# Altium project Resolver_digital.PrjPcb
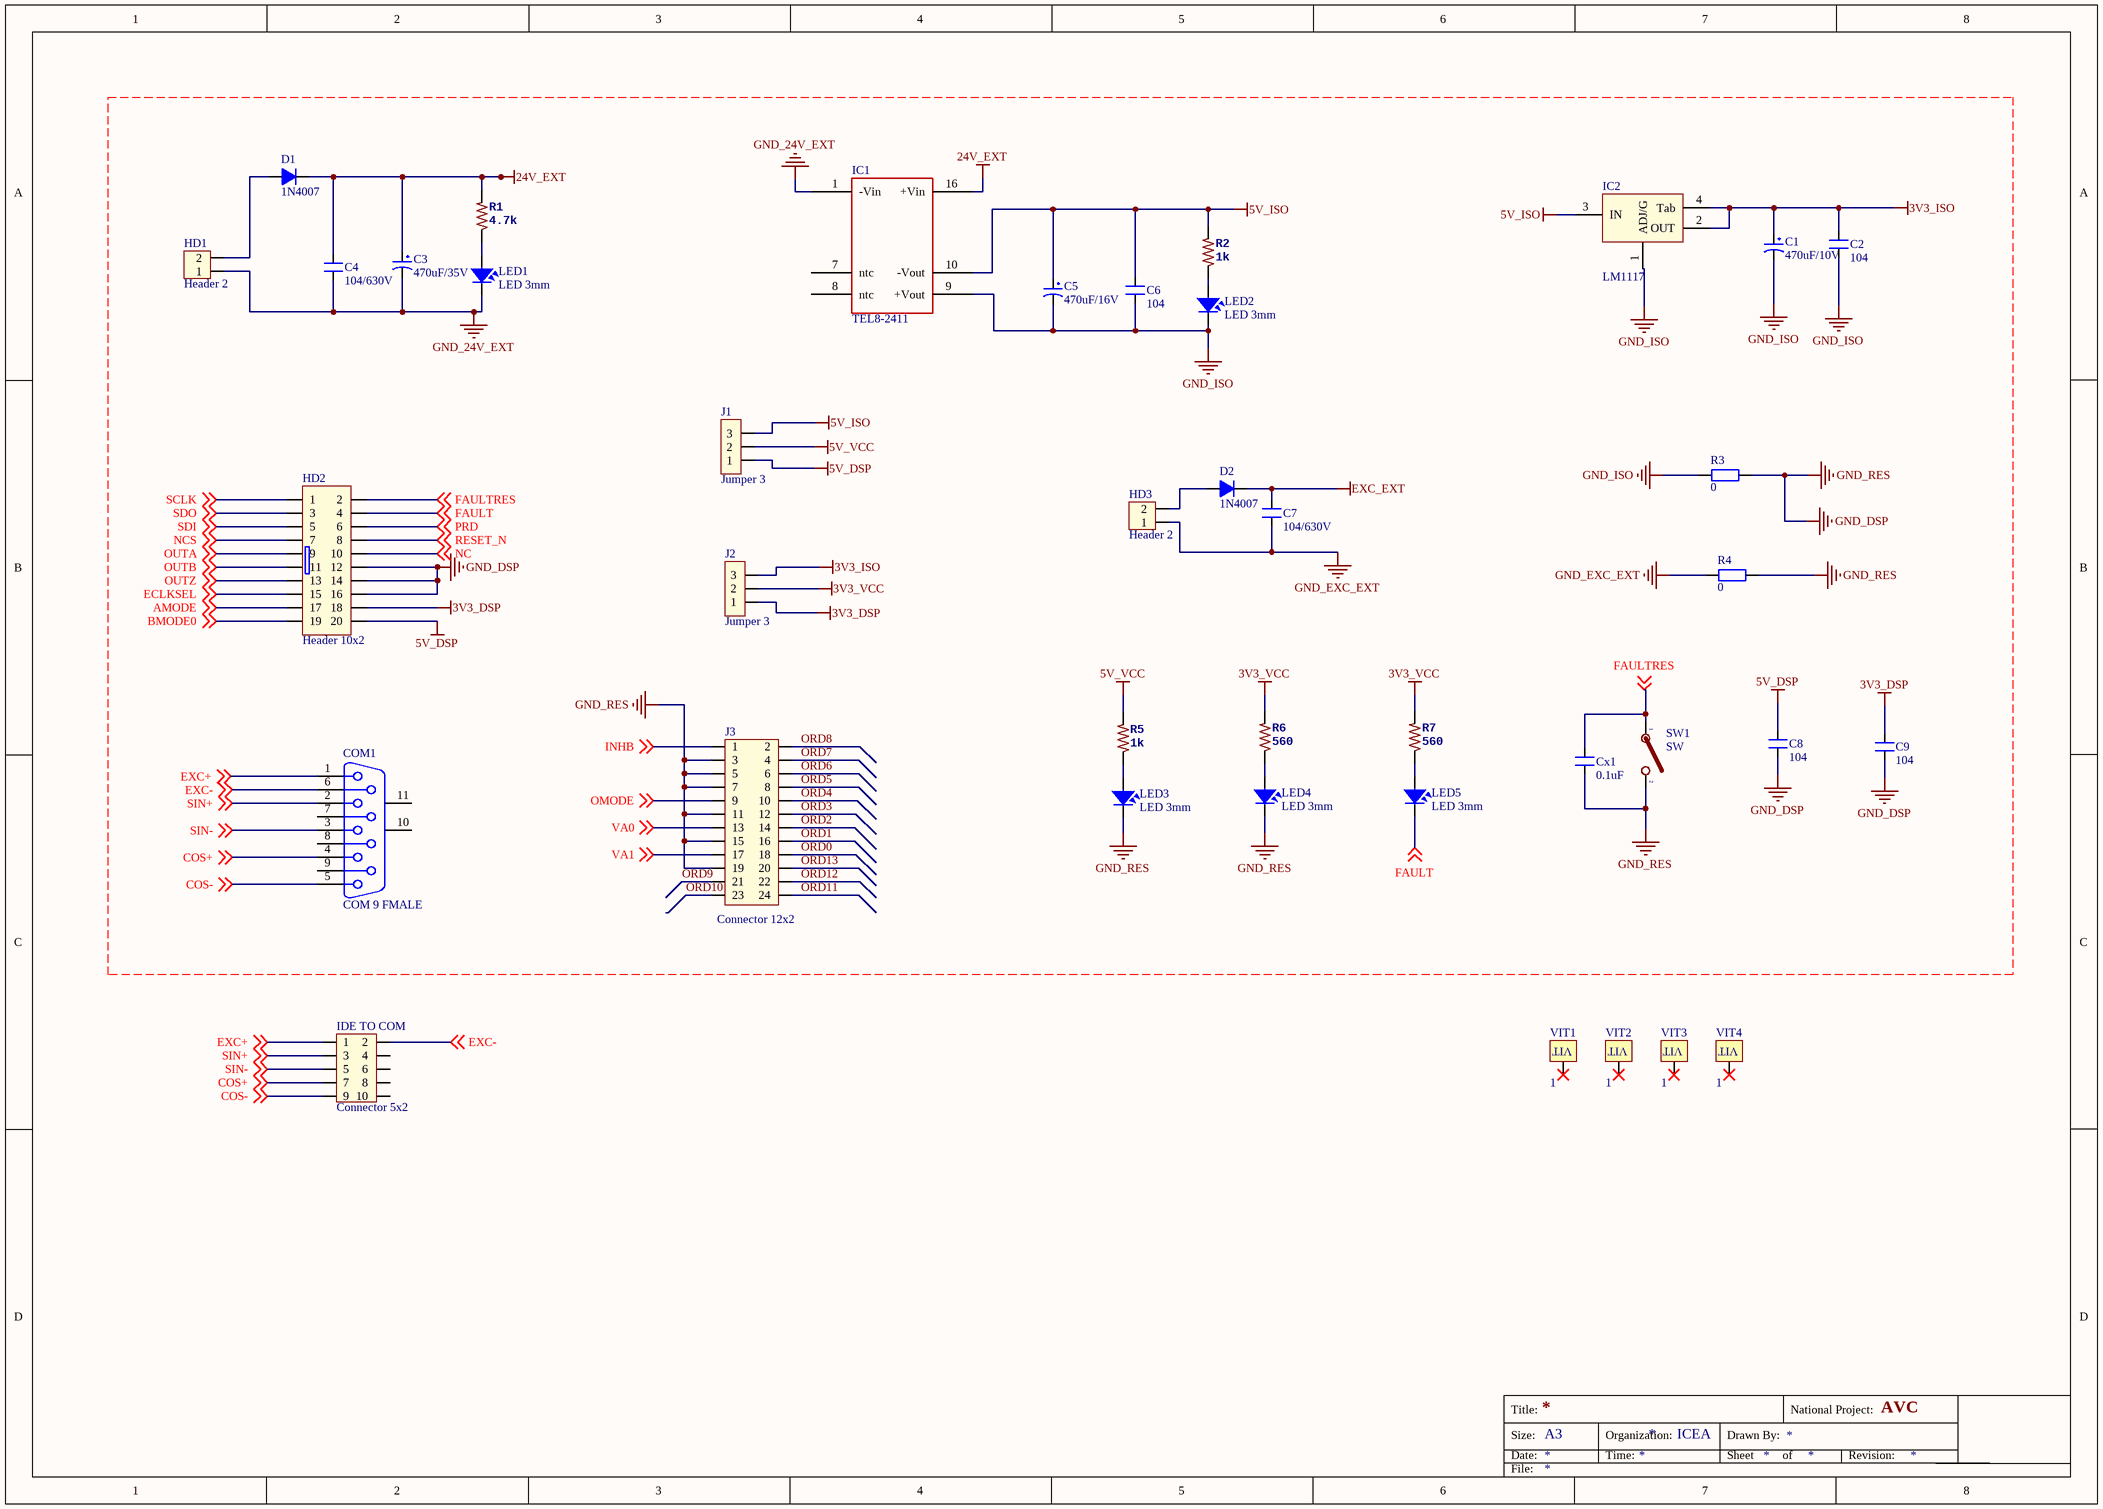
[diagram p0: QEP.SchDoc]
2 sheets, 127 parts. Net scope: global (net labels, ports and power ports of the same name join across sheets).
Board file: Resolver_PCB.PcbDoc
Sheets:
  QEP.SchDoc
  Resolver.SchDoc

## Sheet QEP.SchDoc
size A3

### Parts
C1  470uF/10V  [CP 470uF/35V SMD 10x10mm]
C2  104  [CN1.5]
C3  470uF/35V  [CP 470uF/35V SMD 10x10mm]
C4  104/630V  [CN3]
C5  470uF/16V  [CP 470uF/35V SMD 10x10mm]
C6  104  [CN1.5]
C7  104/630V  [CN3]
C8  104  [CN1.5]
C9  104  [CN1.5]
COM1  COM 9 FMALE  [DSB 9-F]
Cx1  0.1uF  [CN-SMD-0805]
D1  1N4007  [DIO-SMD-106]
D2  1N4007  [DIO-SMD-106]
HD1  Header 2  [HED2T]
HD2  Header 10x2  [IDE 20]
HD3  Header 2  [HED2T]
IC1  TEL8-2411  [TEL8-2411]
IC2  LM1117  [SOT223-4N]
IDE_TO_COM  Connector 5x2  [IDE 10 duc]
J1  Jumper 3  [JP3-CLOSED]
J2  Jumper 3  [JP3-CLOSED]
J3  Connector 12x2  [JP12X2]
LED1  LED 3mm  [LED-0805-Red]
LED2  LED 3mm  [LED-0805-Red]
LED3  LED 3mm  [LED-0805-Red]
LED4  LED 3mm  [LED-0805-Red]
LED5  LED 3mm  [LED-0805-Red]
R1  4.7k  [SM-0805]
R2  1k  [RES-SMD-0805]
R3  0  [RES-SMD-0805]
R4  0  [RES-SMD-0805]
R5  1k  [RES-SMD-0805]
R6  560  [RES-SMD-0805]
R7  560  [RES-SMD-0805]
SW1  SW  [SW-SMD]
VIT1  1  [VIT]
VIT2  1  [VIT]
VIT3  1  [VIT]
VIT4  1  [VIT]

### Nets
3V3_DSP: C9.2 HD2.18 J2.1
3V3_ISO: C1.1 C2.2 IC2.2(OUT) IC2.4(Tab) J2.3
3V3_VCC: J2.2 R6.2 R7.2
5V_DSP: C8.2 HD2.20 J1.1
5V_ISO: C5.1 C6.2 IC1.10(-Vout) IC2.3(IN) J1.3 R2.2
5V_VCC: J1.2 R5.2
24V_EXT: C3.1 C4.2 D1.2(K) IC1.16(+Vin) R1.2
EXC_EXT: C7.2 D2.2(K)
GND_24V_EXT: C3.2 C4.1 HD1.1 IC1.1(-Vin) LED1.2
GND_DSP: C8.1 C9.1 Cx1.1 HD2.12 HD2.14 HD2.16 J3.3 J3.5 J3.7 J3.11 J3.15 J3.19 LED3.2 LED4.2 R3.2 R4.2 SW1.2  [also labelled GND_RES]
GND_EXC_EXT: C7.1 HD3.1 R4.1
GND_ISO: C1.2 C2.1 C5.2 C6.1 IC1.9(+Vout) IC2.1(ADJ/G) LED2.2 R3.1
AMODE: HD2.17 ; off-sheet AMODE
BMODE0: HD2.19 ; off-sheet BMODE0
COS+: COM1.4 IDE_TO_COM.7 ; off-sheet COS+
COS-: COM1.5 IDE_TO_COM.9 ; off-sheet COS-
ECLKSEL: HD2.15 ; off-sheet ECLKSEL
EXC+: COM1.1 IDE_TO_COM.1 ; off-sheet EXC+
EXC-: COM1.6 IDE_TO_COM.2 ; off-sheet EXC-
FAULT: HD2.4 LED5.2 ; off-sheet FAULT
FAULTRES: Cx1.2 HD2.2 SW1.1 ; off-sheet FAULTRES
INHB: J3.1 ; off-sheet INHB
NC: HD2.10 ; off-sheet NC
NCS: HD2.7 ; off-sheet NCS
OMODE: J3.9 ; off-sheet OMODE
ORD0: J3.18
ORD1: J3.16
ORD2: J3.14
ORD3: J3.12
ORD4: J3.10
ORD5: J3.8
ORD6: J3.6
ORD7: J3.4
ORD8: J3.2
ORD9: J3.21
ORD10: J3.23
ORD11: J3.24
ORD12: J3.22
ORD13: J3.20
OUTA: HD2.9 ; off-sheet OUTA
OUTB: HD2.11 ; off-sheet OUTB
OUTZ: HD2.13 ; off-sheet OUTZ
PRD: HD2.6 ; off-sheet PRD
RESET_N: HD2.8 ; off-sheet RESET_N
SCLK: HD2.1 ; off-sheet SCLK
SDI: HD2.5 ; off-sheet SDI
SDO: HD2.3 ; off-sheet SDO
SIN+: COM1.2 IDE_TO_COM.3 ; off-sheet SIN+
SIN-: COM1.3 IDE_TO_COM.5 ; off-sheet SIN-
VA0: J3.13 ; off-sheet VA0
VA1: J3.17 ; off-sheet VA1
NetD1_1: D1.1(A) HD1.2
NetD2_1: D2.1(A) HD3.2
NetLED1_1: LED1.1 R1.1
NetLED2_1: LED2.1 R2.1
NetLED3_1: LED3.1 R5.1
NetLED4_1: LED4.1 R6.1
NetLED5_1: LED5.1 R7.1

Not connected (* = marked no-connect by the designer): COM1 7 8 9 10(MH1) 11(MH2); IC1 7(ntc) 8(ntc); IDE_TO_COM 4 6 8 10; VIT1 1(VIT)*; VIT2 1(VIT)*; VIT3 1(VIT)*; VIT4 1(VIT)*

### Notes on the sheet
- Title:
- Size:
- Date:
- A3
- Organization:
- Time:
- ICEA
- Sheet
- Drawn By:
- of
- National Project:
- Revision:
- AVC
- File:

### Library data of the parts
C1 C3 C5 = CP3: Cap 100uF/35V - 470uF/16V; Value: 100uF/35V/50V; Description 1: 1000uF/6,3V - 470uF/16V - 330uF - 25V; Description 2: 220uF/35V - 100uF/50V - 63V - 4,7uF/200V; Description 3: 22uF => 33uF100V - 3,3uF => 4,7uF/250V; Description 4: 2,2uF =>3,3uF/350 - 2,2uF/400V - 1uF/450V
C2 C6 C8 C9 = CN1.5: Cap np 682pF => 104pF; Value: 0.01uF
C4 C7 = CN3: Cap np W0.3; Value: 0,047uF; Copyright: VanDungEvn
COM1 = DSB9F: COM 9; PackageDocument: O; Positions: 9; Gender: Receptacle; Value: COM 9; Published: 15-Jun-2001; LatestRevisionDate: 17-Jul-2002; LatestRevisionNote: Re-released for DXP Platform.; DatasheetDocument: 1-Sep-1999; PackageReference: 788750; Publisher: Altium Limited; Orientation: Right Angle
Cx1 = CN: Value: 33pF
D1 D2 = D2A: Diode 2A; Value: 1N4007
HD1 HD3 = Hed2: Header 2 (Green); Value: Header 2
HD2 = HED10X2: Value: Header 5x2
IC2 = LM1117: 3v3; Value: LM317
IDE_TO_COM = JP5x2: Value: Connector 4x2
J1 J2 = JP3: Value: J3
J3 = JP12x2: Value: Connector 4x2
LED1-LED5 = LED 3mm: LED Single colour Green and Red; Value: LED 3 ly Single Colour
R1 R2 R5-R7 = R-US_R0805: RESISTOR, American symbol
R3 R4 = R1/4W: Resistor 1/4W; Value: R1/4W - 1K
SW1 = SW: Switch button 2 pin; Value: SW chip 2 pin
VIT1-VIT4 = VIT: Oc Vit

## Sheet Resolver.SchDoc
size A3
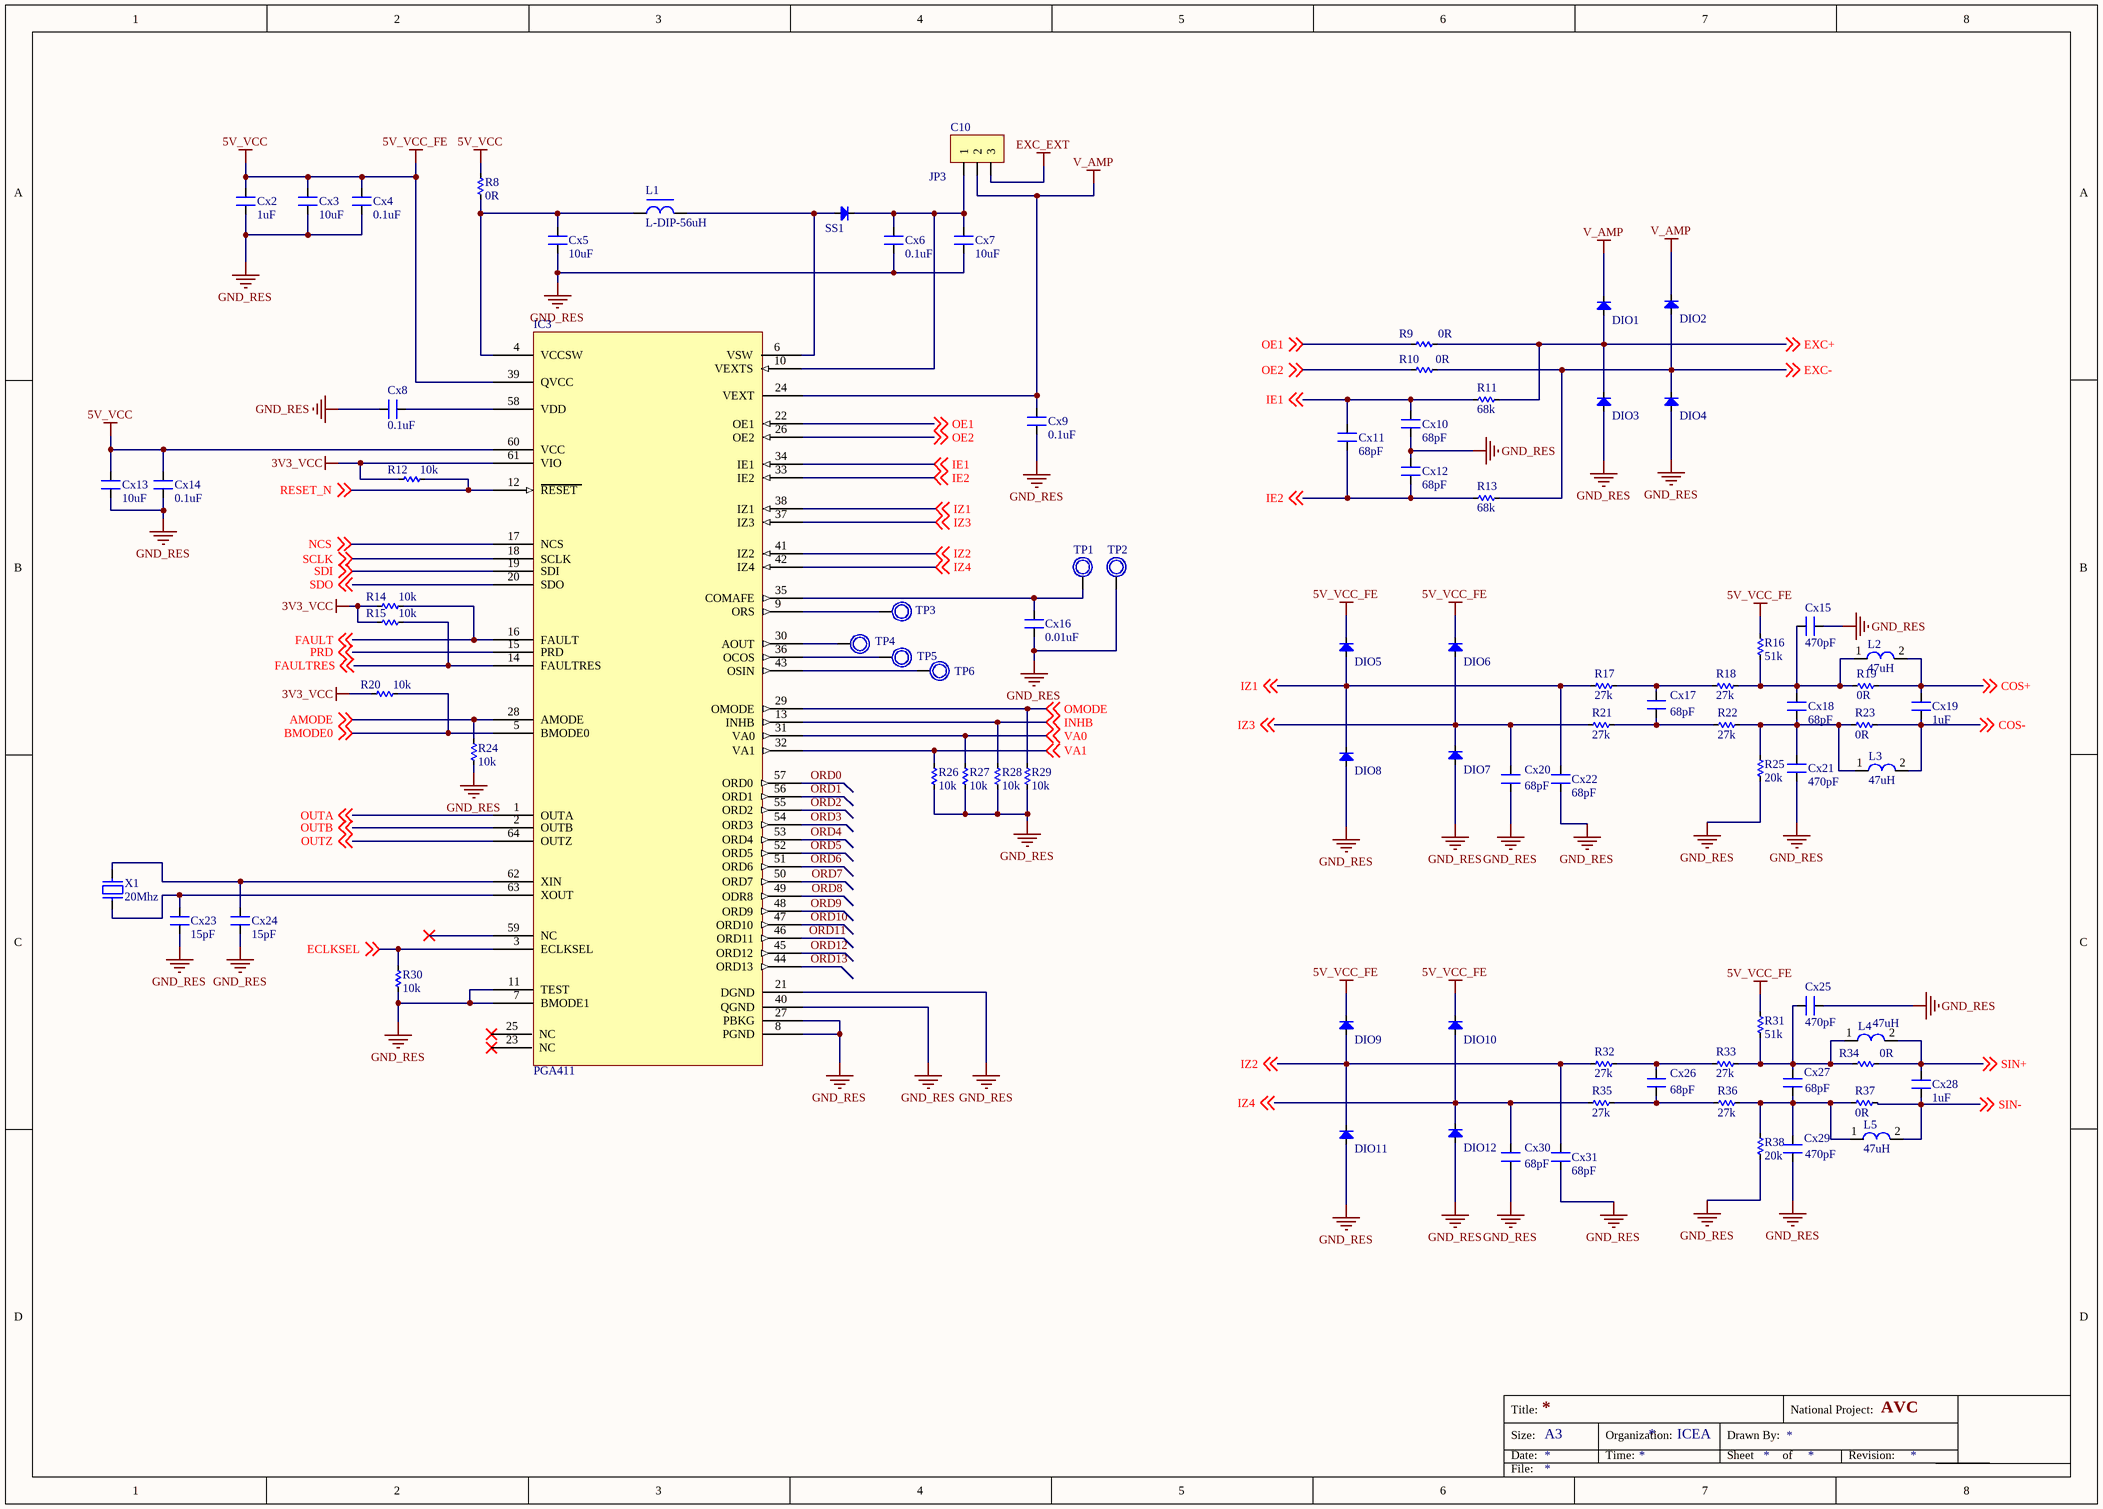
[diagram p1: Resolver.SchDoc]

### Parts
C10  JP3  [JP3-CLOSED]
Cx2  1uF  [CN-SMD-0805]
Cx3  10uF  [CN-SMD-1206]
Cx4  0.1uF  [CN-SMD-0805]
Cx5  10uF  [CN-SMD-1206]
Cx6  0.1uF  [CN-SMD-0805]
Cx7  10uF  [CN-SMD-1206]
Cx8  0.1uF  [CN-SMD-0805]
Cx9  0.1uF  [CN-SMD-0805]
Cx10  68pF  [CN-SMD-0805]
Cx11  68pF  [CN-SMD-0805]
Cx12  68pF  [CN-SMD-0805]
Cx13  10uF  [CN-SMD-1206]
Cx14  0.1uF  [CN-SMD-0805]
Cx15  470pF  [CN-SMD-0805]
Cx16  0.01uF  [CN-SMD-0805]
Cx17  68pF  [CN-SMD-0805]
Cx18  68pF  [CN-SMD-0805]
Cx19  1uF  [CN-SMD-0805]
Cx20  68pF  [CN-SMD-0805]
Cx21  470pF  [CN-SMD-0805]
Cx22  68pF  [CN-SMD-0805]
Cx23  15pF  [CN-SMD-0805]
Cx24  15pF  [CN-SMD-0805]
Cx25  470pF  [CN-SMD-0805]
Cx26  68pF  [CN-SMD-0805]
Cx27  68pF  [CN-SMD-0805]
Cx28  1uF  [CN-SMD-0805]
Cx29  470pF  [CN-SMD-0805]
Cx30  68pF  [CN-SMD-0805]
Cx31  68pF  [CN-SMD-0805]
DIO1  Diode SMD  [DIO-SMD-106]  (value not drawn)
DIO2  Diode SMD  [DIO-SMD-106]  (value not drawn)
DIO3  Diode SMD  [DIO-SMD-106]  (value not drawn)
DIO4  Diode SMD  [DIO-SMD-106]  (value not drawn)
DIO5  Diode SMD  [DIO-SMD-106]  (value not drawn)
DIO6  Diode SMD  [DIO-SMD-106]  (value not drawn)
DIO7  Diode SMD  [DIO-SMD-106]  (value not drawn)
DIO8  Diode SMD  [DIO-SMD-106]  (value not drawn)
DIO9  Diode SMD  [DIO-SMD-106]  (value not drawn)
DIO10  Diode SMD  [DIO-SMD-106]  (value not drawn)
DIO11  Diode SMD  [DIO-SMD-106]  (value not drawn)
DIO12  Diode SMD  [DIO-SMD-106]  (value not drawn)
IC3  PGA411  [PGA411]
L1  L-DIP-56uH  [L-DIP-M-13.5x6]
L2  47uH  [L CD43]
L3  47uH  [L CD43]
L4  47uH  [L CD43]
L5  47uH  [L CD43]
R8  0R  [RES-SMD-0805]
R9  0R  [RES-SMD-0805]
R10  0R  [RES-SMD-0805]
R11  68k  [RES-SMD-0805]
R12  10k  [RES-SMD-0805]
R13  68k  [RES-SMD-0805]
R14  10k  [RES-SMD-0805]
R15  10k  [RES-SMD-0805]
R16  51k  [RES-SMD-0805]
R17  27k  [RES-SMD-0805]
R18  27k  [RES-SMD-0805]
R19  0R  [RES-SMD-0805]
R20  10k  [RES-SMD-0805]
R21  27k  [RES-SMD-0805]
R22  27k  [RES-SMD-0805]
R23  0R  [RES-SMD-0805]
R24  10k  [RES-SMD-0805]
R25  20k  [RES-SMD-0805]
R26  10k  [RES-SMD-0805]
R27  10k  [RES-SMD-0805]
R28  10k  [RES-SMD-0805]
R29  10k  [RES-SMD-0805]
R30  10k  [RES-SMD-0805]
R31  51k  [RES-SMD-0805]
R32  27k  [RES-SMD-0805]
R33  27k  [RES-SMD-0805]
R34  0R  [RES-SMD-0805]
R35  27k  [RES-SMD-0805]
R36  27k  [RES-SMD-0805]
R37  0R  [RES-SMD-0805]
R38  20k  [RES-SMD-0805]
SS1  Diode SMD  [DIO-SMD-106]  (value not drawn)
TP1  TP  [Test Point]  (value not drawn)
TP2  TP  [Test Point]  (value not drawn)
TP3  TP  [Test Point]  (value not drawn)
TP4  TP  [Test Point]  (value not drawn)
TP5  TP  [Test Point]  (value not drawn)
TP6  TP  [Test Point]  (value not drawn)
X1  20Mhz  [XT2 SMD]

### Nets
3V3_VCC: IC3.61(VIO) R12.2 R14.2 R15.2 R20.2
5V_VCC: Cx2.2 Cx3.2 Cx4.2 Cx13.2 Cx14.2 DIO5.2(K) DIO6.2(K) DIO9.2(K) DIO10.2(K) IC3.39(QVCC) IC3.60(VCC) R8.1 R16.1 R31.1  [also labelled 5V_VCC_FE]
EXC_EXT: C10.3
GND_RES: Cx2.1 Cx3.1 Cx4.1 Cx5.1 Cx6.1 Cx7.1 Cx8.2 Cx9.1 Cx10.1 Cx12.2 Cx13.1 Cx14.1 Cx15.1 Cx16.1 Cx20.1 Cx21.1 Cx22.2 Cx23.1 Cx24.1 Cx25.1 Cx29.1 Cx30.1 Cx31.2 DIO3.1(A) DIO4.1(A) DIO7.1(A) DIO8.1(A) DIO11.1(A) DIO12.1(A) IC3.7(BMODE1) IC3.8(PGND) IC3.11(TEST) IC3.21(DGND) IC3.27(PBKG) IC3.40(QGND) R24.2 R25.2 R26.2 R27.2 R28.2 R29.2 R30.2 R38.2 TP2.1  [project net GND_DSP]
V_AMP: C10.2 Cx9.2 DIO1.2(K) DIO2.2(K) IC3.24(VEXT)
AMODE: IC3.28(AMODE) R24.1 ; off-sheet AMODE
BMODE0: IC3.5(BMODE0) R20.1 ; off-sheet BMODE0
COS+: Cx19.2 L2.2 R19.1 ; off-sheet COS+
COS-: Cx19.1 L3.2 R23.1 ; off-sheet COS-
ECLKSEL: IC3.3(ECLKSEL) R30.1 ; off-sheet ECLKSEL
EXC+: DIO1.1(A) DIO3.2(K) R9.1 R11.1 ; off-sheet EXC+
EXC-: DIO2.1(A) DIO4.2(K) R10.1 R13.1 ; off-sheet EXC-
FAULT: IC3.16(FAULT) R14.1 ; off-sheet FAULT
FAULTRES: IC3.14(FAULTRES) R15.1 ; off-sheet FAULTRES
IE1: Cx10.2 Cx11.2 IC3.34(IE1) R11.2 ; off-sheet IE1
IE2: Cx11.1 Cx12.1 IC3.33(IE2) R13.2 ; off-sheet IE2
INHB: IC3.13(INHB) R28.1 ; off-sheet INHB
IZ1: Cx22.1 DIO5.1(A) DIO8.2(K) IC3.38(IZ1) R17.2 ; off-sheet IZ1
IZ2: Cx31.1 DIO9.1(A) DIO11.2(K) IC3.41(IZ2) R32.2 ; off-sheet IZ2
IZ3: Cx20.2 DIO6.1(A) DIO7.2(K) IC3.37(IZ3) R21.2 ; off-sheet IZ3
IZ4: Cx30.2 DIO10.1(A) DIO12.2(K) IC3.42(IZ4) R35.2 ; off-sheet IZ4
NCS: IC3.17(NCS) ; off-sheet NCS
OE1: IC3.22(OE1) R9.2 ; off-sheet OE1
OE2: IC3.26(OE2) R10.2 ; off-sheet OE2
OMODE: IC3.29(OMODE) R29.1 ; off-sheet OMODE
ORD0: IC3.57(ORD0)
ORD1: IC3.56(ORD1)
ORD2: IC3.55(ORD2)
ORD3: IC3.54(ORD3)
ORD4: IC3.53(ORD4)
ORD5: IC3.52(ORD5)
ORD6: IC3.51(ORD6)
ORD7: IC3.50(ORD7)
ORD8: IC3.49(ODR8)
ORD9: IC3.48(ORD9)
ORD10: IC3.47(ORD10)
ORD11: IC3.46(ORD11)
ORD12: IC3.45(ORD12)
ORD13: IC3.44(ORD13)
OUTA: IC3.1(OUTA) ; off-sheet OUTA
OUTB: IC3.2(OUTB) ; off-sheet OUTB
OUTZ: IC3.64(OUTZ) ; off-sheet OUTZ
PRD: IC3.15(PRD) ; off-sheet PRD
RESET_N: IC3.12(RESET) R12.1 ; off-sheet RESET_N
SCLK: IC3.18(SCLK) ; off-sheet SCLK
SDI: IC3.19(SDI) ; off-sheet SDI
SDO: IC3.20(SDO) ; off-sheet SDO
SIN+: Cx28.2 L4.2 R34.1 ; off-sheet SIN+
SIN-: Cx28.1 L5.2 R37.1 ; off-sheet SIN-
VA0: IC3.31(VA0) R27.1 ; off-sheet VA0
VA1: IC3.32(VA1) R26.1 ; off-sheet VA1
NetC10_1: C10.1 Cx6.2 Cx7.2 IC3.10(VEXTS) SS1.2(K)
NetCx5_2: Cx5.2 IC3.4(VCCSW) L1.1 R8.2
NetCx8_1: Cx8.1 IC3.58(VDD)
NetCx15_2: Cx15.2 Cx18.2 L2.1 R16.2 R18.1 R19.2
NetCx16_2: Cx16.2 IC3.35(COMAFE) TP1.1
NetCx17_1: Cx17.1 R21.1 R22.2
NetCx17_2: Cx17.2 R17.1 R18.2
NetCx18_1: Cx18.1 Cx21.2 L3.1 R22.1 R23.2 R25.1
NetCx23_2: Cx23.2 IC3.63(XOUT) X1.1
NetCx24_2: Cx24.2 IC3.62(XIN) X1.2
NetCx25_2: Cx25.2 Cx27.2 L4.1 R31.2 R33.1 R34.2
NetCx26_1: Cx26.1 R35.1 R36.2
NetCx26_2: Cx26.2 R32.1 R33.2
NetCx27_1: Cx27.1 Cx29.2 L5.1 R36.1 R37.2 R38.1
NetIC3_6: IC3.6(VSW) L1.2 SS1.1(A)
NetIC3_9: IC3.9(ORS) TP3.1
NetIC3_30: IC3.30(AOUT) TP4.1
NetIC3_36: IC3.36(OCOS) TP5.1
NetIC3_43: IC3.43(OSIN) TP6.1

Not connected (* = marked no-connect by the designer): IC3 23(NC)* 25(NC)* 59(NC)*

### Notes on the sheet
- Title:
- Size:
- Date:
- A3
- Organization:
- Time:
- ICEA
- Sheet
- Drawn By:
- of
- National Project:
- Revision:
- AVC
- File:

### Library data of the parts
C10 = JP3: WR-PHD 2.54 mm Angled Socket Header; Manufacturer: W¨¹rth Elektronik eiSos GmbH; partNo: 613003143121; ComponentLink1 Description: Manufacturer; ComponentLink2 Description: Datasheet; NoPins: 03; Created Date: 29 March 2013; ComponentLink1URL: http://www.we-online.com; ComponentLink2URL: http://katalog.we-online.de/em/datasheet/6130xx143121.pdf; Created by: Karrer Zheng
Cx2-Cx31 = CN: Value: 33pF
DIO1-DIO12 SS1 = Diode SMD: Default Diode; Code - JEDEC: DO-214-AB; Value: 1N5007; Published: 8-Jun-2000; Revision: July-2002: Re-released for DXP Platform.; Publisher: Altium Limited
L1 = L-DIP-1: Inductor; Value: 150 mH
L2-L5 = L-SMD-1: partNo: 78477010; Manufacturer: Wurth Elektronik; Inductance: 1.0 μH; ComponentLink1Description: Manufacturer; ComponentLink1URL: http://www.we-online.de; Created by: Baojun Chen; Created Date: Nov.2015; ComponentLink2Description: Datasheet; ComponentLink2URL: http://katalog.we-online.de/pbs/datasheet/78477010.pdf
R8-R38 = Res-SMD: Resistor; Manufacturer: Generic Components; Class: Passive; Published: 08/06/2000; Publisher: Altium Hobart Technology Centre
TP1-TP6 = TP1: Test Point; Value: Test Point
X1 = XT2: Crystal, 32.768 KHz, -40 to 85 degC, 3.2 x 1.5 x 0.9 mm SMD; Value: 4Mhz

## Nets that join several sheets
3V3_VCC: QEP (J2.2 R6.2 R7.2), Resolver (5 pins)
5V_VCC: QEP (J1.2 R5.2), Resolver (14 pins)
EXC_EXT: QEP (C7.2 D2.2), Resolver (C10.3)
GND_DSP: QEP (17 pins), Resolver (44 pins)
AMODE: QEP (HD2.17), Resolver (IC3.28 R24.1)
BMODE0: QEP (HD2.19), Resolver (IC3.5 R20.1)
COS+: QEP (COM1.4 IDE_TO_COM.7), Resolver (Cx19.2 L2.2 R19.1)
COS-: QEP (COM1.5 IDE_TO_COM.9), Resolver (Cx19.1 L3.2 R23.1)
ECLKSEL: QEP (HD2.15), Resolver (IC3.3 R30.1)
EXC+: QEP (COM1.1 IDE_TO_COM.1), Resolver (DIO1.1 DIO3.2 R9.1 R11.1)
EXC-: QEP (COM1.6 IDE_TO_COM.2), Resolver (DIO2.1 DIO4.2 R10.1 R13.1)
FAULT: QEP (HD2.4 LED5.2), Resolver (IC3.16 R14.1)
FAULTRES: QEP (Cx1.2 HD2.2 SW1.1), Resolver (IC3.14 R15.1)
INHB: QEP (J3.1), Resolver (IC3.13 R28.1)
NCS: QEP (HD2.7), Resolver (IC3.17)
OMODE: QEP (J3.9), Resolver (IC3.29 R29.1)
ORD0: QEP (J3.18), Resolver (IC3.57)
ORD1: QEP (J3.16), Resolver (IC3.56)
ORD2: QEP (J3.14), Resolver (IC3.55)
ORD3: QEP (J3.12), Resolver (IC3.54)
ORD4: QEP (J3.10), Resolver (IC3.53)
ORD5: QEP (J3.8), Resolver (IC3.52)
ORD6: QEP (J3.6), Resolver (IC3.51)
ORD7: QEP (J3.4), Resolver (IC3.50)
ORD8: QEP (J3.2), Resolver (IC3.49)
ORD9: QEP (J3.21), Resolver (IC3.48)
ORD10: QEP (J3.23), Resolver (IC3.47)
ORD11: QEP (J3.24), Resolver (IC3.46)
ORD12: QEP (J3.22), Resolver (IC3.45)
ORD13: QEP (J3.20), Resolver (IC3.44)
OUTA: QEP (HD2.9), Resolver (IC3.1)
OUTB: QEP (HD2.11), Resolver (IC3.2)
OUTZ: QEP (HD2.13), Resolver (IC3.64)
PRD: QEP (HD2.6), Resolver (IC3.15)
RESET_N: QEP (HD2.8), Resolver (IC3.12 R12.1)
SCLK: QEP (HD2.1), Resolver (IC3.18)
SDI: QEP (HD2.5), Resolver (IC3.19)
SDO: QEP (HD2.3), Resolver (IC3.20)
SIN+: QEP (COM1.2 IDE_TO_COM.3), Resolver (Cx28.2 L4.2 R34.1)
SIN-: QEP (COM1.3 IDE_TO_COM.5), Resolver (Cx28.1 L5.2 R37.1)
VA0: QEP (J3.13), Resolver (IC3.31 R27.1)
VA1: QEP (J3.17), Resolver (IC3.32 R26.1)